# EAGLE design Reciever (EAGLE 9.6.2)
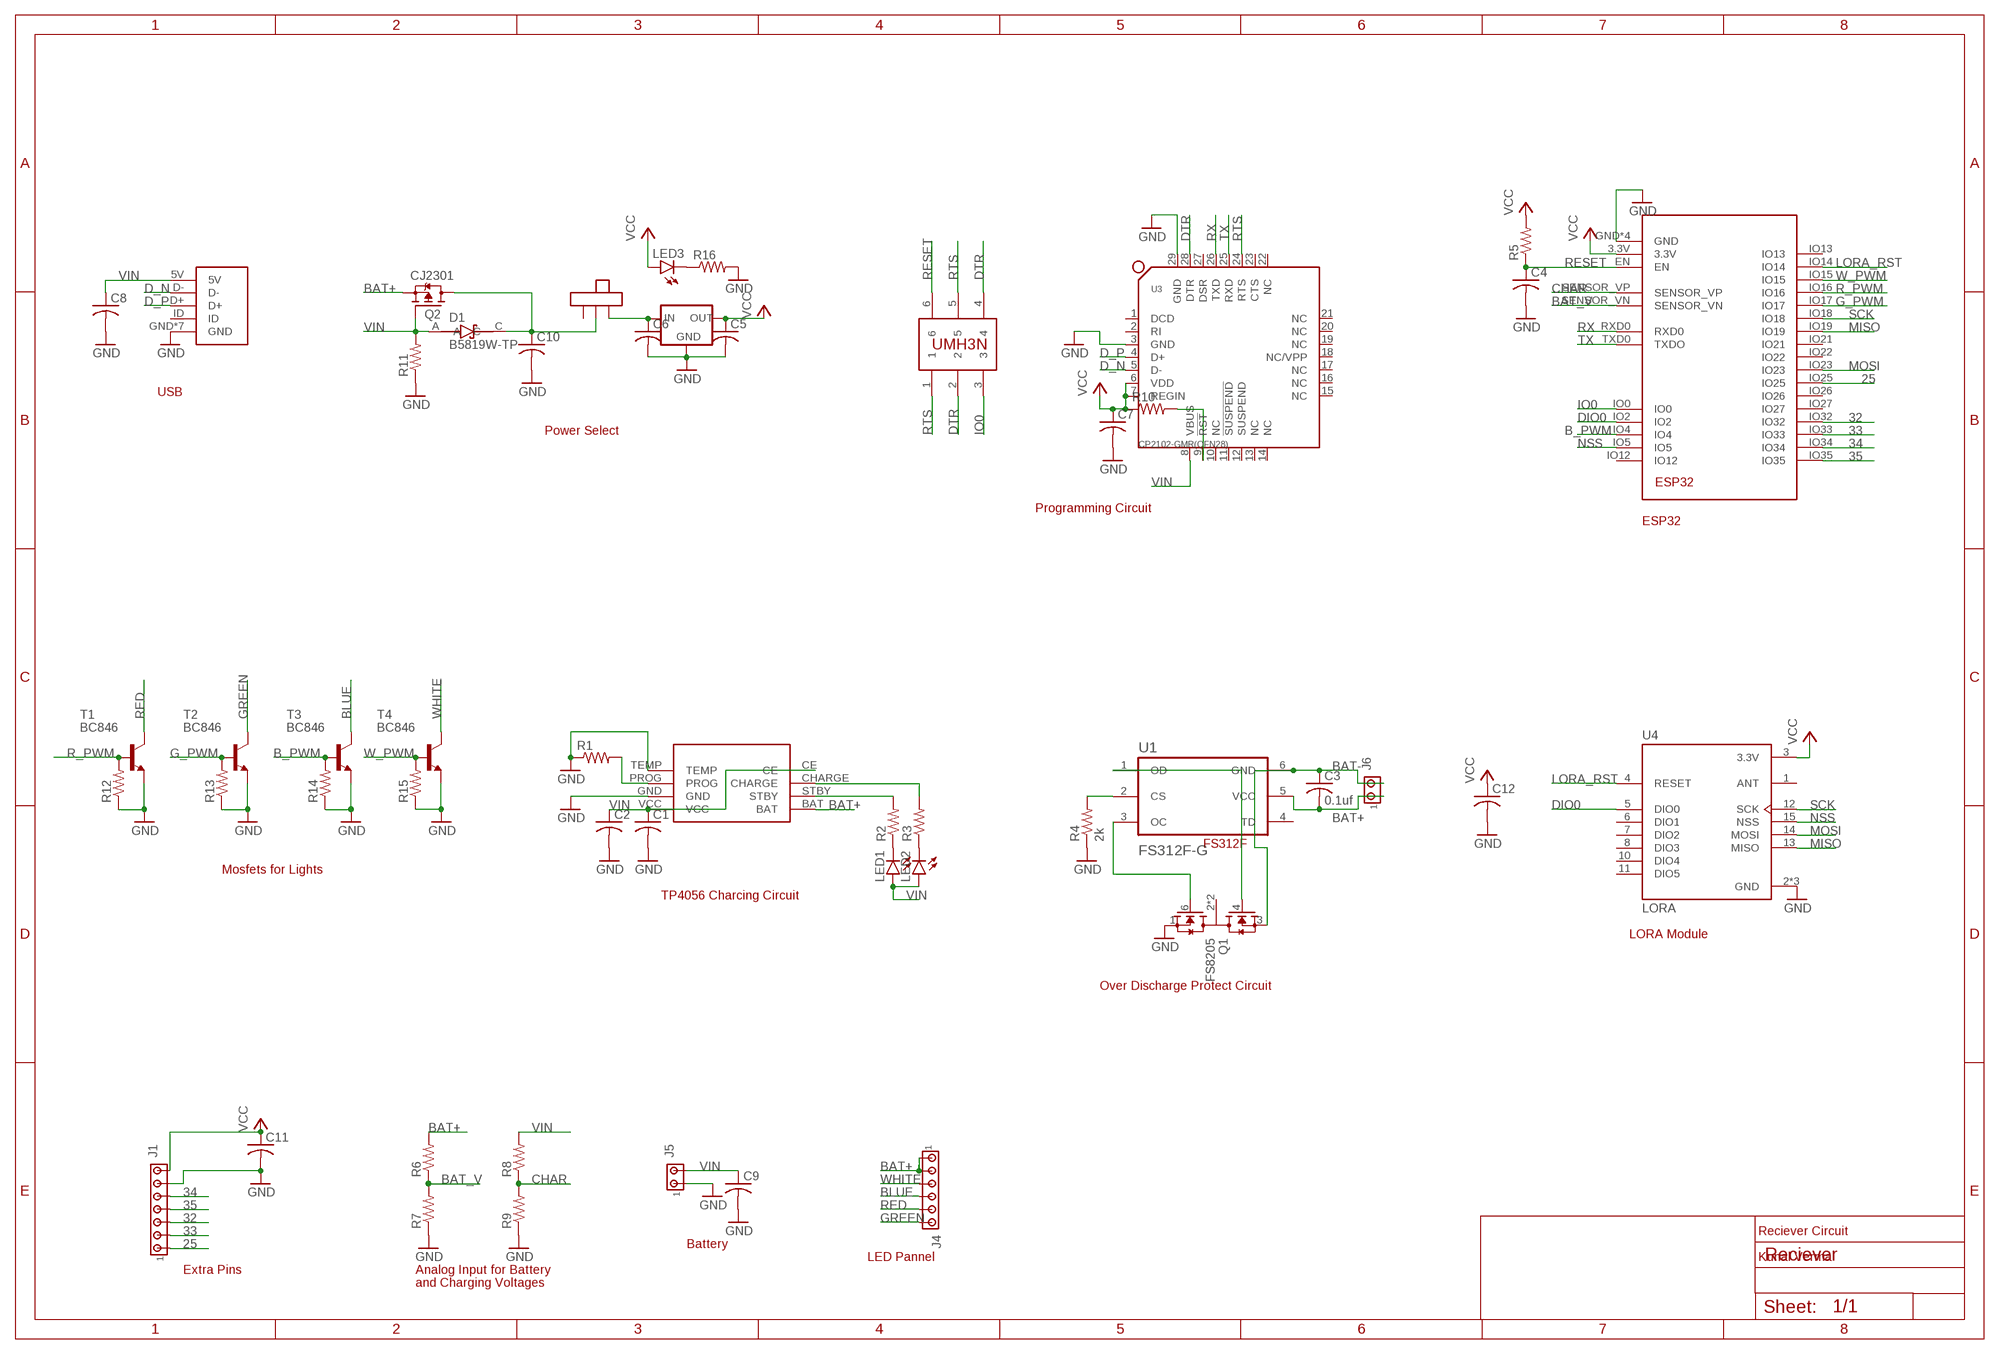
[diagram p0: schematic, sheet 1]

## Parts
C1  C-USC0603  [C0603]
C2  C-USC0603  [C0603]
C3  0.1uf  C-USC0603  [C0603]
C4  C-USC0603  [C0603]
C5  C-USC0603  [C0603]
C6  C-USC0603  [C0603]
C7  C-USC0603  [C0603]
C8  C-USC0603  [C0603]
C9  C-USC0603  [C0603]
C10  C-USC0603  [C0603]
C11  C-USC0603  [C0603]
C12  C-USC0603  [C0603]
D1  B5819W-TP  [SOD3716X135N]
IC1  V_REG3.3MP  [SOT223]
J1  MTA07-100  [10X07MTA]
J4  MTA06-156  [1X6MTA]
J5  MTA02-156  [1X2MTA]
J6  MTA02-156  [1X2MTA]
LED1  LEDCHIPLED_0603  [CHIPLED_0603]
LED2  LEDCHIPLED_0603  [CHIPLED_0603]
LED3  LEDCHIP-LED0603  [CHIP-LED0603]
Q1  FS8205  [SOT95P280X145-6N]
Q2  CJ2301  [SOT95P230X110-3N]
R1  R-US_R0603  [R0603]
R2  R-US_R0603  [R0603]
R3  R-US_R0603  [R0603]
R4  2k  R-US_R0603  [R0603]
R5  R-US_R0603  [R0603]
R6  R-US_R0603  [R0603]
R7  R-US_R0603  [R0603]
R8  R-US_R0603  [R0603]
R9  R-US_R0603  [R0603]
R10  R-US_R0603  [R0603]
R11  R-US_R0603  [R0603]
R12  R-US_R0603  [R0603]
R13  R-US_R0603  [R0603]
R14  R-US_R0603  [R0603]
R15  R-US_R0603  [R0603]
R16  R-US_R0603  [R0603]
T1  BC846  [SOT23]
T2  BC846  [SOT23]
T3  BC846  [SOT23]
T4  BC846  [SOT23]
U1  FS312F-G  [SOT223-6]
U2  ESP32  [MODULE_ESP-WROOM-32]
U3  CP2102-GMR(QFN28)  [QFN28G_0.5-5X5MM]
U4  LORA  [XCVR_RA-01H]
U$1  TP4056  [TP4056]
U$2  SELF-TOOGLE-SWITCH  [SELF-TOOGLE-SWITCH]
U$3  MICROUSB  [USB]
U$4  UMH3N  [UMH3N]

## Nets
25: J1.1 U2.IO25
32: J1.3 U2.IO32
33: J1.2 U2.IO33
34: J1.5 U2.IO34
35: J1.4 U2.IO35
B_PWM: R14.2 T3.1(B) U2.IO4
BAT+: C3.2 J4.1 J4.2 J6.1 Q2.2(S) R6.2 U1.5(VCC) U$1.BAT
BAT-: C3.1 J6.2 Q1.3(S2) U1.6(GND)
BAT_V: R6.1 R7.2 U2.SENSOR_VN
BLUE: J4.4 T3.3(C)
CHAR: R8.1 R9.2 U2.SENSOR_VP
D_N: U3.5(D-) U$3.D-
D_P: U3.4(D+) U$3.D+
DIO0: U2.IO2 U4.5(DIO0)
DTR: U3.28(DTR) U$4.2 U$4.4
G_PWM: R13.2 T2.1(B) U2.IO17
GND: C1.2 C2.2 C4.2 C5.2 C6.2 C7.2 C8.2 C9.2 C10.2 C11.2 C12.2 IC1.GND J1.6 J5.1 Q1.1(S1) R1.1 R4.1 R7.1 R9.1 R11.1 R12.1 R13.1 R14.1 R15.1 R16.2 T1.2(E) T2.2(E) T3.2(E) T4.2(E) U2.GND U2.GND1(GND) U2.GND2(GND) U2.GND3(GND) U3.3(GND) U3.29(GND) U4.2(GND) U4.9(GND) U4.16(GND) U$1.GND U$1.TEMP U$3.GND U$3.GND1(GND) U$3.GND2(GND) U$3.GND3(GND) U$3.GND4(GND) U$3.GND5(GND) U$3.GND6(GND)
GREEN: J4.6 T2.3(C)
IO0: U2.IO0 U$4.3
LORA_RST: U2.IO14 U4.4(RESET)
MISO: U2.IO19 U4.13(MISO)
MOSI: U2.IO23 U4.14(MOSI)
N$1: R1.2 U$1.PROG
N$2: LED1.C R2.1
N$3: R4.2 U1.2(CS)
N$4: LED2.C R3.1
N$5: Q1.4(G2) U1.1(OD)
N$6: R2.2 U$1.STBY
N$7: R3.2 U$1.CHARGE
N$8: Q1.6(G1) U1.3(OC)
N$9: C10.1 D1.C Q2.3(D) U$2.2
N$10: R10.2 U3.9(!RST)
N$11: LED3.C R16.1
N$12: C6.1 IC1.VIN(IN) U$2.3
NSS: U2.IO5 U4.15(NSS)
R_PWM: R12.2 T1.1(B) U2.IO16
RED: J4.5 T1.3(C)
RESET: C4.1 R5.1 U2.EN U$4.6
RTS: U3.24(RTS) U$4.1 U$4.5
RX: U2.RXD0 U3.26(TXD)
SCK: U2.IO18 U4.12(SCK)
TX: U2.TXD0(TXDO) U3.25(RXD)
VCC: C5.1 C7.1 C11.1 C12.1 IC1.VOUT1(OUT) IC1.VOUT(OUT) J1.7 LED3.A R5.2 R10.1 U2.3.3V U3.6(VDD) U3.7(REGIN) U4.3(3.3V)
VIN: C1.1 C2.1 C8.1 C9.1 D1.A J5.2 LED1.A LED2.A Q2.1(G) R8.2 R11.2 U3.8(VBUS) U$1.CE U$1.VCC U$3.5V
W_PWM: R15.2 T4.1(B) U2.IO15
WHITE: J4.3 T4.3(C)
Unconnected: Q1.2(D12) Q1.5(D12) U1.4(TD) U2.IO12 U2.IO13 U2.IO21 U2.IO22 U2.IO26 U2.IO27 U3.1(DCD) U3.2(RI) U3.10(NC) U3.11(!SUSPEND) U3.12(SUSPEND) U3.13(NC) U3.14(NC) U3.15(NC) U3.16(NC) U3.17(NC) U3.18(NC/VPP) U3.19(NC) U3.20(NC) U3.21(NC) U3.22(NC) U3.23(CTS) U3.27(DSR) U4.1(ANT) U4.6(DIO1) U4.7(DIO2) U4.8(DIO3) U4.10(DIO4) U4.11(DIO5) U$2.1 U$3.ID

## Notes on the sheet
- USB
- Power Select
- Programming Circuit
- ESP32
- Mosfets for Lights
- TP4056 Charcing Circuit
- LORA Module
- Over Discharge Protect Circuit
- Reciever Circuit
- Battery
- LED Pannel | Kunal Verma
- Extra Pins | Analog Input for Battery
- and Charging Voltages

## Library data of the parts
C1-C12 = rcl:C-US: CAPACITOR, American symbol; SPICEPREFIX: C
D1 = B5819W-TP:B5819W-TP: Diode Schottky 20v 1a Sod123 Check availability <https://pricing.snapeda.com/parts/B5819W-TP/Micro%20Commercial/view-part?ref=eda>; AVAILABILITY: In Stock; DESCRIPTION: Diode Schottky 40 V 1A Surface Mount SOD-123; MF: Micro Commercial; MP: B5819W-TP; PACKAGE: SOD-123 Multicomp; PRICE: None; PURCHASE-URL: https://pricing.snapeda.com/search/part/B5819W-TP/?ref=eda
IC1 = V_REG:V_REG: 800mA Low-Dropout Linear Regulator Source: http://www.ti.com/lit/ds/symlink/lm1117-n.pdf; MF: Texas Instruments; MPN: LM1117MP-3.3; OC_FARNELL: 9778195; OC_NEWARK: 28X3416
J1 = con-amp:MTA07-100: AMP connector
J4 = con-amp:MTA06-156: AMP connector
J5 J6 = con-amp:MTA02-156: AMP connector
LED1-LED3 = led:LED: LED OSRAM: - CHIPLED LG R971, LG N971, LY N971, LG Q971, LY Q971, LO R971, LY R971 LH N974, LH R974 LS Q976, LO Q976, LY Q976 LO Q996 - Hyper CHIPLED LW Q18S LB Q993, LB Q99A, LB R99A - SideLED LS A670, LO A670, LY A670, LG A670, LP A670 LB A673, LV A673, LT A673, LW A673 LH A674 LY A675 LS A676, LA A676, LO A676, LY A676, LW A676 LS A679, LY A679, LG A679 - Hyper Micro SIDELED® LS Y876, LA Y876, LO Y876, LY Y876 LT Y87S - SmartLED LW L88C, LW L88S LB L89C, LB L89S, LG L890 LS L89K, LO L89K, LY L89K LS L896, LA L896, LO L896, LY L896 - TOPLED LS T670, LO T670, LY T670, LG T670, LP T670 LSG T670, LSP T670, LSY T670, LOP T670, LYG T670 LG T671, LOG T671, LSG T671 LB T673, LV T673, LT T673, LW T673 LH T674 LS T676, LA T676, LO T676, LY T676, LB T676, LH T676, LSB T676, LW T676 LB T67C, LV T67C, LT T67C, LS T67K, LO T67K, LY T67K, LW E67C LS E67B, LA E67B, LO E67B, LY E67B, LB E67C, LV E67C, LT E67C LW T67C LS T679, LY T679, LG T679 LS T770, LO T770, LY T770, LG T770, LP T770 LB T773, LV T773, LT T773, LW T773 LH T774 LS E675, LA E675, LY E675, LS T675 LS T776, LA T776, LO T776, LY T776, LB T776 LHGB T686 LT T68C, LB T68C - Hyper Mini TOPLED® LB M676 - Mini TOPLED Santana® LG M470 LS M47K, LO M47K, LY M47K Source: http://www.osram.convergy.de LUXEON: - LUMILED® LXK2-PW12-R00, LXK2-PW12-S00, LXK2-PW14-U00, LXK2-PW14-V00 LXK2-PM12-R00, LXK2-PM12-S00, LXK2-PM14-U00 LXK2-PE12-Q00, LXK2-PE12-R00, LXK2-PE12-S00, LXK2-PE14-T00, LXK2-PE14-U00 LXK2-PB12-K00, LXK2-PB12-L00, LXK2-PB12-M00, LXK2-PB14-N00, LXK2-PB14-P00, LXK2-PB14-Q00 LXK2-PR12-L00, LXK2-PR12-M00, LXK2-PR14-Q00, LXK2-PR14-R00 LXK2-PD12-Q00, LXK2-PD12-R00, LXK2-PD12-S00 LXK2-PH12-R00, LXK2-PH12-S00 LXK2-PL12-P00, LXK2-PL12-Q00, LXK2-PL12-R00 Source: www.luxeon.com KINGBRIGHT: KA-3528ASYC Source: www.kingbright.com
Q1 = FS8205:FS8205: Dual N Channel Enhancement Mode Power MOSFET Check prices <https://pricing.snapeda.com/parts/FS8205/Fortune%20Semiconductor/view-part?ref=eda>; AVAILABILITY: In Stock; DESCRIPTION: Dual N-Channel Enhancement Mode Power MOSFET; MF: Fortune Semiconductor; MP: FS8205; PACKAGE: Package; PRICE: None
Q2 = PMV65XP_215:CJ2301: Single P-Channel 20 V 833 mW 7.7 nC Silicon Surface Mount Mosfet - SOT-23 Check availability <https://pricing.snapeda.com/parts/PMV65XP%2C215/Nexperia%20USA%20Inc./view-part?ref=eda>; AVAILABILITY: In Stock; DESCRIPTION: P-Channel 20 V 2.8A (Ta) 480mW (Ta) Surface Mount TO-236AB; MF: Nexperia USA Inc.; MP: PMV65XP,215; PACKAGE: SOT23-3 Nexperia USA Inc.; PRICE: None; PURCHASE-URL: https://pricing.snapeda.com/search/part/PMV65XP,215/?ref=eda
R1-R16 = rcl:R-US_: RESISTOR, American symbol; SPICEPREFIX: R
T1-T4 = transistor:BC846: NPN TRANSISTOR
U1 = REF3440IDBVR:FS312F-G: Check prices <https://pricing.snapeda.com/parts/REF3440IDBVR/Texas%20Instruments/view-part?ref=eda>; AVAILABILITY: In Stock; DESCRIPTION: 4.1-V low-drift low-power small-footprint series voltage reference 6-SOT-23 -40 to 125; MF: Texas Instruments; MP: REF3440IDBVR; PACKAGE: SOT-23-6 Texas Instruments; PRICE: None; PURCHASE-URL: https://pricing.snapeda.com/search/part/REF3440IDBVR/?ref=eda
U2 = ESP-WROOM-32:ESP32: Module: combo; GPIO, I2C x2, I2S x2, SDIO, SPI x3, UART x3; 19.5dBm
U3 = CP2102-GMR_QFN28_:CP2102-GMR(QFN28): 310070003 Check prices <https://pricing.snapeda.com/parts/CP2102-GMR/Silicon/view-part?ref=eda>; AVAILABILITY: Warning; DESCRIPTION: USB Bridge, USB to UART USB 2.0 UART Interface 28-QFN (5x5); MF: Silicon; MP: CP2102-GMR; PACKAGE: VFQFN-28 Vishay Siliconix; PRICE: None; PURCHASE-URL: https://pricing.snapeda.com/search/part/CP2102-GMR/?ref=eda
U4 = RA-01H:LORA: Ai-Thinker Lora Series Module Check availability <https://pricing.snapeda.com/parts/RA-01H/AI-Thinker/view-part?ref=eda>; AVAILABILITY: Not in stock; DESCRIPTION: Ai-Thinker Lora Series Module; MF: AI-Thinker; MP: RA-01H; PACKAGE: Package; PRICE: None
U$1 = TP4056:TP4056
U$2 = SELF-TOOGLE-SWITCH:SELF-TOOGLE-SWITCH
U$3 = micro usb:MICROUSB
U$4 = UMH3N:UMH3N

## Board
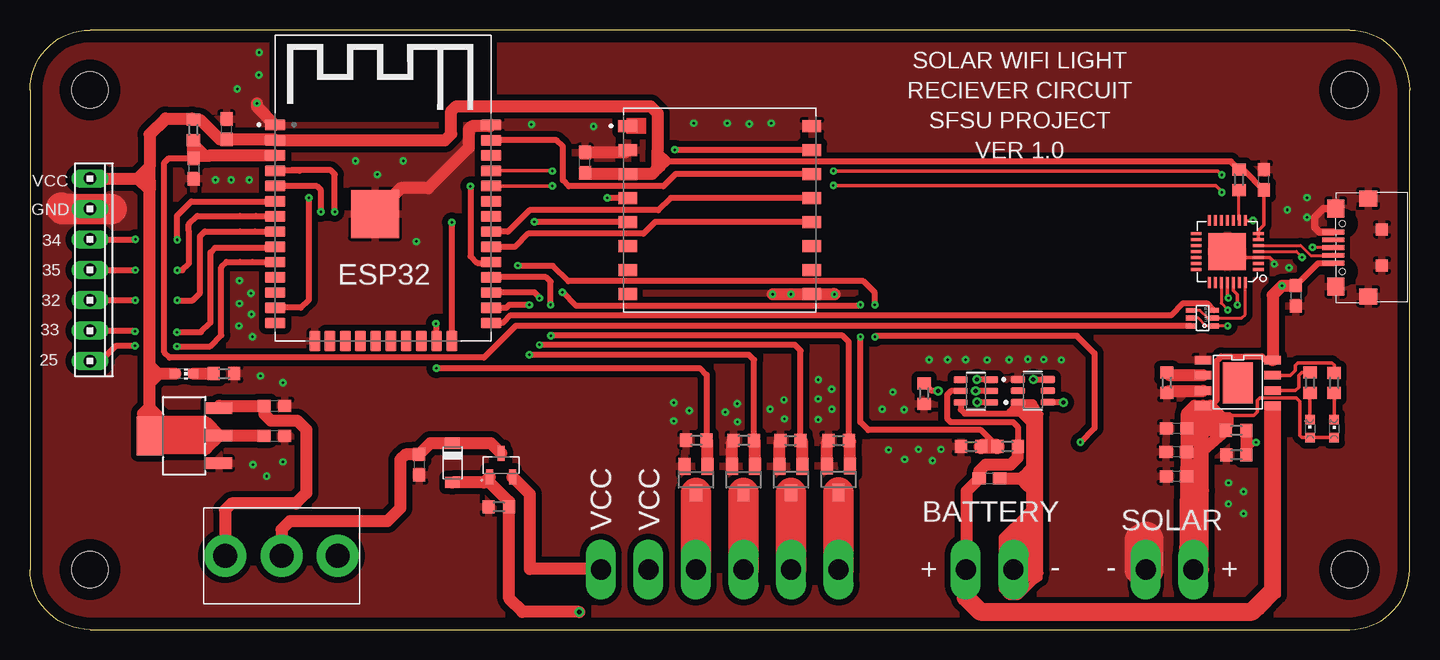
[diagram p1: board, top side]
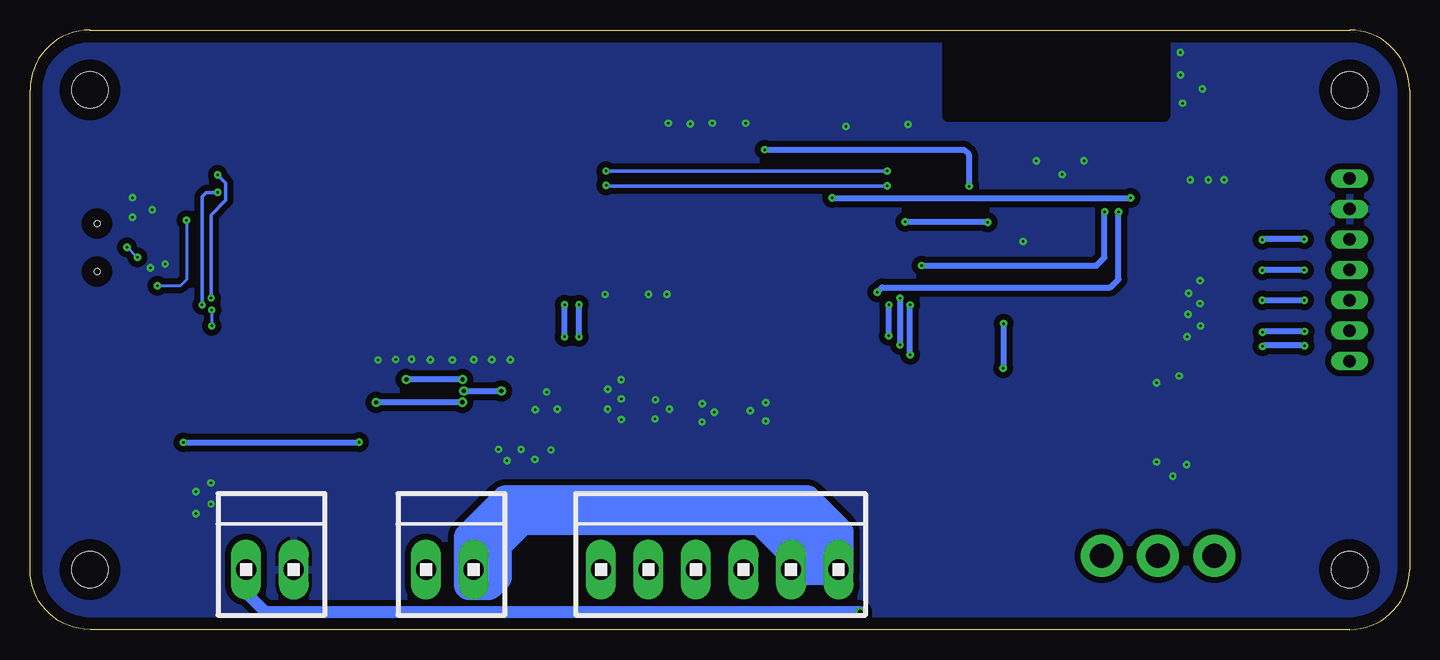
[diagram p2: board, bottom side, seen from below]

Size 115 x 50 mm. Coordinates in mm from the lower left corner, seen from the top.
Outline: 5,0 110,0 arc90 115,5 115,45 arc90 110,50 5,50 arc90 0,45 0,5 arc90 5,0
Copper layers (1*16): Top 0.035mm / dielectric 1.5mm / Bottom 0.035mm
Design rules "default *": minimum track width 6mil, minimum drill 0.35mm, track to track 6mil, track to pad 6mil, pad to pad 6mil, via to via 6mil, smd to smd 6mil, copper to edge 40mil, drill to drill 6mil, minimum pad ring 10mil, minimum via ring 8mil, stop-mask expansion 4mil, vias tented up to drill 100mil, thermal gap 10mil
Holes 3 mm at 5,5 110,5 5,45 110,45

### Footprints (pad centres in the part's own frame; a part is rotated, then mirrored left to right if it is on the bottom)
C0603 = smd 1.1 x 1: 1 -0.85,0; 2 0.85,0
SOD3716X135N = smd 0.914 x 1.219: A 1.638,0; C -1.638,0
SOT223 = smd 0.95 x 2.15: GND -2.3,-2.9; VIN 2.3,-2.9; VOUT 0,-2.9 | smd 3.25 x 2.15: VOUT1 0,2.9
10X07MTA = drill 1.016 long: 1 7.62,0; 2 5.08,0; 3 2.54,0; 4 0,0; 5 -2.54,0; 6 -5.08,0; 7 -7.62,0
1X6MTA = drill 1.676 long: 1 9.906,0; 2 5.944,0; 3 1.981,0; 4 -1.981,0; 5 -5.944,0; 6 -9.906,0
1X2MTA = drill 1.676 long: 1 1.981,0; 2 -1.981,0
CHIPLED_0603 = smd 0.8 x 0.8: A 0,-0.75; C 0,0.75
CHIP-LED0603 = smd 0.8 x 0.8: A 0,-0.75; C 0,0.75
SOT95P280X145-6N = smd 1.21 x 0.59: 1 -1.255,0.95; 2 -1.255,0; 3 -1.255,-0.95; 4 1.255,-0.95; 5 1.255,0; 6 1.255,0.95
SOT95P230X110-3N = smd 0.59 x 1.26: 1 -0.95,-0.98; 2 0.95,-0.98; 3 0,0.98
R0603 = smd 1 x 1.1: 1 -0.85,0; 2 0.85,0
SOT23 = smd 1 x 1.4: 1 -0.95,-1.1; 2 0.95,-1.1; 3 0,1.1
SOT223-6 = smd 1.21 x 0.58: 1 -1.255,0.95; 2 -1.255,0; 3 -1.255,-0.95; 4 1.255,-0.95; 5 1.255,0; 6 1.255,0.95
MODULE_ESP-WROOM-32 = smd 1.7 x 0.9: 3.3V -9,6.985; EN -9,5.715; GND -9,8.255; GND3 9,8.255; IO0 9,-8.255; IO4 9,-6.985; IO5 9,-3.175; IO12 -9,-8.255; IO14 -9,-6.985; IO16 9,-5.715; IO17 9,-4.445; IO18 9,-1.905; IO19 9,-0.635; IO21 9,1.905; IO22 9,5.715; IO23 9,6.985; IO25 -9,-3.175; IO26 -9,-4.445; IO27 -9,-5.715; IO32 -9,-0.635; IO33 -9,-1.905; IO34 -9,1.905; IO35 -9,0.635; NC 9,0.635; RXD0 9,3.175; SENSOR_VN -9,3.175; SENSOR_VP -9,4.445; TXD0 9,4.445 | smd 0.9 x 1.7: CLK 0.635,-9.755; CMD -0.635,-9.755; GND2 -5.715,-9.755; IO2 5.715,-9.755; IO13 -4.445,-9.755; IO15 4.445,-9.755; SD0 1.905,-9.755; SD1 3.175,-9.755; SD2 -3.175,-9.755; SD3 -1.905,-9.755 | smd 4 x 4: GND1 -0.7,0.845
QFN28G_0.5-5X5MM = smd 0.9 x 0.254: 1 -2.59,1.5; 2 -2.59,1; 3 -2.59,0.5; 4 -2.59,0; 5 -2.59,-0.5; 6 -2.59,-1; 7 -2.59,-1.5; 15 2.59,-1.5; 16 2.59,-1; 17 2.59,-0.5; 18 2.59,0; 19 2.59,0.5; 20 2.59,1; 21 2.59,1.5 | smd 0.254 x 0.9: 8 -1.5,-2.59; 9 -1,-2.59; 10 -0.5,-2.59; 11 0,-2.59; 12 0.5,-2.59; 13 1,-2.59; 14 1.5,-2.59; 22 1.5,2.59; 23 1,2.59; 24 0.5,2.59; 25 0,2.59; 26 -0.5,2.59; 27 -1,2.59; 28 -1.5,2.59 | smd 3.1 x 3.1: 29 0,0
XCVR_RA-01H = smd 1.536 x 1: 1 -7.682,7; 2 -7.682,5; 3 -7.682,3; 4 -7.682,1; 5 -7.682,-1; 6 -7.682,-3; 7 -7.682,-5; 8 -7.682,-7; 9 7.682,-7; 10 7.682,-5; 11 7.682,-3; 12 7.682,-1; 13 7.682,1; 14 7.682,3; 15 7.682,5; 16 7.682,7
TP4056 = smd 1.4 x 0.7: BAT 2.9,-1.27; CE 2.9,2.54; CHARGE 2.9,1.27; GND -2.9,0; PROG -2.9,1.27; STBY 2.9,0; TEMP -2.9,2.54; VCC -2.9,-1.27 | smd 2.5 x 3.4: PAD 0,0.635
SELF-TOOGLE-SWITCH = drill 2 pad 3.5: 1 -4.7,0; 2 0,0; 3 4.7,0
USB = smd 0.4 x 1.8: 5V -1.298,0.204; D+ 0.002,0.204; D- -0.648,0.204; GND 1.302,0.204; ID 0.652,0.204 | smd 1.5 x 1.4: GND1 3.25,0; GND6 -3.25,0 | smd 1.35 x 1.5: GND2 4.075,-2.7; GND5 -4.075,-2.7 | smd 1 x 1: GND3 1.5,-3.85; GND4 -1.5,-3.85 | hole 0.5: -2,-0.55; 2,-0.55
UMH3N = smd 0.4 x 0.8: 1 -0.65,-0.97; 2 0,-0.97; 3 0.65,-0.97; 4 0.65,0.97; 5 0,0.97; 6 -0.65,0.97

### Placement (x,y rotation side)
C1  95.56,14.81 180 top
C2  95.59,16.79 180 top
C3  79.98,12.59 180 top
C4  13.64,38.44 270 top
C5  20.37,16.17 0 top
C6  20.37,18.67 0 top
C7  102.86,37.52 90 top
C8  105.51,27.83 270 top
C9  95.57,12.78 180 top
C10  32.44,13.75 270 top
C11  16.39,41.73 90 top
C12  46.25,38.94 90 top
D1  35.22,13.89 270 top
IC1  12.87,16.17 90 top
J1  5,30 270 top
J4  57.5,5 0 bottom
J5  95,5 0 bottom
J6  80,5 0 bottom
LED1  106.7,16.75 0 top
LED2  108.72,16.75 0 top
LED3  12.86,21.32 270 top
Q1  83.6,19.9 0 top
Q2  39.27,13.71 0 top
R1  94.76,20.58 90 top
R2  106.7,20.58 90 top
R3  108.72,20.56 90 top
R4  74.54,19.68 90 top
R5  13.62,41.67 90 top
R6  81.49,15.27 0 top
R7  78.45,15.26 0 top
R8  100.56,16.62 180 top
R9  100.56,14.57 0 top
R10  100.78,37.51 270 top
R11  39.09,10.23 0 top
R12  63.4,15.77 0 top
R13  67.41,15.77 0 top
R14  59.51,15.78 0 top
R15  55.55,15.79 0 top
R16  16.17,21.34 0 top
T1  63.43,12.51 180 top
T2  67.41,12.53 180 top
T3  59.48,12.5 180 top
T4  55.52,12.49 180 top
U1  78.85,19.89 180 top
U2  29.45,33.82 0 top
U3  99.79,31.53 180 top
U4  57.5,35 0 top
U$1  100.69,19.93 0 top
U$2  20.96,6.15 180 top
U$3  108.85,31.85 90 top
U$4  97.72,25.97 90 top

### Tracks (layer width: path | path; a pad name or v marks a point on that pad's centre or on a via)
25  (via drill 0.2)
  Top 0.508: J1.1 5.91,22.38 7.2,23.67 v8.75,23.67 | v12.25,23.61 15,23.61 15.94,24.55 15.94,30.21 16.39,30.66 17.5,30.66 18.54,30.66 20.43,30.66 U2.IO25
  Bottom 0.508: v8.75,23.67 12.19,23.67 v12.25,23.61
32  (via drill 0.2)
  Top 0.508: J1.3 v8.77,27.46 v8.78,27.45 | v12.27,27.45 13.57,27.45 14.19,28.07 14.19,32.81 14.57,33.19 17.5,33.19 18.74,33.19 20.44,33.19 U2.IO32
  Bottom 0.508: v8.78,27.45 v12.27,27.45
33  (via drill 0.2)
  Top 0.508: J1.2 8.69,24.92 v8.75,24.86 | v12.25,24.8 14.25,24.8 15.04,25.59 15.04,31.46 15.43,31.84 20.38,31.84 U2.IO33
  Bottom 0.508: v8.75,24.86 12.19,24.86 v12.25,24.8
34  (via drill 0.2)
  Top 0.508: J1.5 8.77,32.54 v8.78,32.55 | v12.27,32.5 12.27,34.51 13.46,35.7 20.42,35.7 U2.IO34
  Bottom 0.508: v8.78,32.55 12.21,32.55 v12.27,32.5
35  (via drill 0.2)
  Top 0.508: J1.4 8.76,30 v8.78,29.98 | v12.27,29.97 12.69,29.97 13.26,30.54 13.26,33.2 13.24,33.22 13.24,33.8 13.94,34.5 17.5,34.5 18.83,34.5 20.41,34.5 U2.IO35
  Bottom 0.508: v8.78,29.98 12.26,29.98 v12.27,29.97
B_PWM  (via drill 0.2)
  Top 0.508: R14.2 60.36,22.48 59.93,22.91 v41.64,22.91 | v41.64,27.07 39.94,27.07 39.69,26.82 38.47,26.82 U2.IO4
  Top 1.016: T3.1 60.42,15.71 R14.2
  Bottom 0.508: v41.64,22.91 v41.64,27.07
BAT+
  Top 0.508: U$1.BAT 103.12,18.19 103.12,3.48 103.49,3.12 | U$1.BAT 103.88,18.37 104.03,18.37 104.03,2.88 102.65,1.49 101.86,1.49 | U$1.BAT 103.59,3.22 102.92,2.56 | U1.5 76.76,19.89 76.44,19.58 76.44,17.62 76.75,17.31 81.94,17.31 82.35,16.91 R6.2
  Top 1.016: J6.1 78.07,5.05 78.07,11.52 C3.2 79.13,13.22 79.67,13.76 81.75,13.76 82.34,14.35 R6.2 | Q2.2 41.65,11.3 41.65,5.05 47.55,5.05 J4.1
  Top 1.5: J6.1 78.02,2.69 79.21,1.49 101.86,1.49 102.92,2.56 103.49,3.12
  Bottom 2.54: J4.2 J4.1 47.59,8.11 50.28,10.79 75.29,10.79 78.02,8.07 | J4.2 51.56,6.59 54.09,9.13 74.04,9.13 76.12,7.04 76.12,4.36 76.76,3.73 78.4,3.73 78.4,4.62 | 78.4,4.62 J6.1 78.02,8.07 | 78.02,8.07 78.4,7.69 78.4,4.62 | J4.2 50.49,6.06 49.93,6.06 49.93,7.58 51.13,8.78 52.37,8.78
BAT-
  Top 0.508: 83.63,18.95 82.86,18.95 | 82.86,18.95 82.55,18.95 | 82.55,18.95 Q1.3 | 82.48,18 83.27,17.22 83.27,13.2 83.27,11.9 83.27,10 82.88,9.61 | 82.48,18 81.98,18.51 | 82.88,9.61 80.99,7.72 80.99,5.16 | 80.99,5.16 80.99,3.34 81.58,2.75 82.44,2.75 83.67,3.97 | 83.67,3.97 83.67,4.29 | 83.67,4.29 83.67,9.79 | 83.72,12.55 83.72,9.86 83.67,9.79 | 83.72,18.87 83.72,17.79 | 83.72,18.87 83.63,18.95 | Q1.3 81.98,18.59 81.98,18.51 | Q1.3 83.03,17.66 | 83.03,17.66 83.25,17.24 | 82.55,18.95 83.03,17.66 | 83.72,18.87 83.19,18.5 | 82.48,18 83.19,18.5 | 83.19,18.5 82.86,18.95 | 83.19,18.5 83.72,17.25 | 80.99,5.16 81.67,5.05 J6.2 83.25,4.47 | 83.05,8.91 83.37,9.38 | 83.37,9.38 83.67,9.79 | 83.37,9.38 82.88,9.61 | 83.63,18.95 84.23,17.94 84.23,4.71 84.19,4.67 84.19,4.3 83.67,3.97 | 83.25,4.47 83.67,4.29 | 83.67,4.29 83.72,4.27 | 83.67,3.97 83.25,4.47 | U1.6 77.59,18.34 77.92,18 81.68,18 | 81.68,18 82.48,18 | 81.98,18.51 81.68,18.2 81.68,18
  Top 0.813: 83.72,17.79 83.72,17.25 83.72,12.55 83.72,4.27
  Top 1.016: J6.2 81.61,5.79 | J6.2 81.64,6.79 81.61,7.3 83.05,8.91 83.02,4.41 82.59,3.95 | 82.59,3.95 82.15,3.47 81.77,3.45 81.67,3.88 81.67,5.05 | J6.2 82.4,7.21 | J6.2 82.59,3.95 | C3.1 82.55,12.59 | 82.65,12.59 83.68,12.59 83.72,12.55 | 82.65,12.59 82.55,12.59 | 82.65,12.59 83.27,13.2 | 82.55,12.59 83.23,11.9 83.27,11.9
BAT_V  (via drill 0.2)
  Top 0.508: R6.1 79.27,16.64 69.89,16.64 69.23,17.3 v69.23,24.4 | v69.23,27.07 69.14,26.99 45.53,26.99 44.39,28.14 v44.38,28.12 | v24.26,34.83 24.26,36.64 23.93,36.97 20.47,36.97 U2.SENSOR_VN
  Top 1.27: R6.1 R7.2
  Bottom 0.508: v69.23,24.4 v69.23,27.07 | v44.38,28.12 43.97,28.53 24.93,28.53 24.26,29.21 v24.26,34.83
BLUE
  Top 2.54: T3.3 J4.4
CHAR  (via drill 0.2)
  Top 0.508: 101.41,15 102.02,15.6 v102.21,15.6 | v87.56,15.62 88.75,16.8 88.75,23.02 87.28,24.48 70.51,24.48 v70.43,24.41 | v70.43,27.08 70.43,28.09 69.47,29.04 44.88,29.04 43.6,30.33 40.67,30.33 v40.67,30.35 | v25.4,34.82 25.4,37.96 25.07,38.29 22.5,38.29 | 22.5,38.29 21.78,38.29 | 22.5,38.29 22.47,38.27 U2.SENSOR_VP
  Top 1.016: R8.1 101.41,16.61 101.41,15 R9.2
  Bottom 0.508: v102.21,15.6 87.57,15.6 v87.56,15.62 | v70.43,24.41 v70.43,27.07 v70.43,27.08 | v40.67,30.35 26.1,30.35 25.43,31.02 25.43,34.8 v25.4,34.82 | v25.4,34.82
D_N
  Top 0.254: U3.5 105.94,32.03 106.76,31.21 U$3.D-
D_P  (via drill 0.2)
  Top 0.254: U3.4 105.56,31.53 v106.05,31.04 | v106.92,31.88 108.63,31.88 U$3.D+
  Bottom 0.254: v106.05,31.04 106.89,31.88 v106.92,31.88
DIO0  (via drill 0.2)
  Top 0.508: U4.5 v42.05,34 | v35.16,33.97 v35.16,33.96 U2.IO2
  Bottom 0.508: v42.05,34 35.19,34 v35.16,33.97
DTR
  Top 0.254: U3.28 101.29,26.24 101.02,25.97 U$4.2 98.19,25.97 97.54,26.62 U$4.4
G_PWM  (via drill 0.2)
  Top 0.508: R13.2 68.26,23.99 67.75,24.51 43.43,24.51 v43.42,24.49 | v43.4,27.07 43.4,29 43.01,29.39 38.46,29.39 U2.IO17
  Top 1.016: T2.1 68.36,15.67 R13.2
  Bottom 0.508: v43.42,24.49 43.42,27.05 v43.4,27.07
GND  (via drill 0.2)
  Top 0.305: U3.29 99.79,31.5 100.27,31.03 U3.3 103.36,31.03 103.94,30.44
  Top 0.61: U$3.GND 107.48,33.16 107.1,33.53 107.1,34.39 107.81,35.11 U$3.GND1
  Top 1.016: U4.2 49.61,39.79 C12.2 | U2.GND3 38.34,41.97 36.82,41.97 36.57,41.73 36.57,40.17 33.2,36.79 30.88,36.79 U2.GND1 | R1.1 94.91,19.87 97.74,19.87 U$1.GND | v61.9,27.96 v63.44,27.96 65.14,27.96 U4.9 67.01,28 v67.07,27.94 | T2.2 66.46,15.66 R13.1 | T1.2 62.48,15.7 R12.1 | T3.2 58.52,15.65 R14.1 | U2.GND 18.92,43.61 v18.92,43.89
  Top 2.54: 93.02,7.5 92.5,7.5 92.5,5 | 2.61,35.18 2.71,35.08 J1.6 6.79,35.08 6.83,35.04
  Top 3: J5.1 93.02,7.5
  other vias: 65.71,17.51 66.85,18.38 65.72,19.23 66.83,20.05 65.72,20.82 62.9,17.56 61.69,18.39 62.85,19.15 58.98,17.31 57.95,18.11 58.95,18.83 53.67,17.39 54.96,18.25 53.66,18.91 19.22,21.15 21.08,20.58 18.58,13.75 21.08,13.98 19.73,12.8 19.08,46.24 19.1,48.12 17.28,45.08 27.14,39.08 31.11,39.08 28.95,37.95 32.21,32.36 55.34,42.23 58.12,42.23 61.78,42.23 41.8,42.13 46.98,41.95 59.97,42.16 106.46,34.37 106.46,36.02 104.82,35 18.55,24.42 18.47,26.29 18.43,28.04 17.45,27.19 17.41,25.32 17.45,29.1 71.04,18.37 72.86,18.33 71.93,19.8 75.95,15.02 74.06,15.02 71.57,14.98 72.91,14.19 75.24,14.09 81.62,22.5 83.19,22.54 84.52,22.52 85.98,22.48 79.79,22.48 78.01,22.49 76.5,22.5 74.95,22.49 99.92,12.23 101.16,11.5 99.9,10.47 101.18,9.68 103.73,30.48 104.95,30.17 15.47,37.5 16.77,37.5 18.28,37.5
  pour Top (isolate 0.5): -2.5,0 -2.5,52.5 117.5,52.5 117.5,-2.5 -2.5,-2.5
  pour Bottom (isolate 0.5): -10,-7.5 -10,57.5 122.5,57.5 125,57.5 125,-7.5
GREEN
  Top 2.54: T2.3 J4.6 | J4.6
IO0
  Top 0.508: U$4.3 98.08,27.23 96.12,27.23 96.12,27.22 95.13,26.23 40.08,26.23 40.08,26.22 39.43,25.57 39.42,25.56 U2.IO0
LORA_RST  (via drill 0.2)
  Top 0.508: U4.4 v48.14,36 | v23.24,36 23.24,27.5 22.58,26.83 U2.IO14
  Bottom 0.508: v48.14,36 v23.24,36
MISO
  Top 0.508: U4.13 53.41,36 52.37,34.96 41.63,34.96 39.85,33.19 U2.IO19
MOSI
  Top 0.508: U4.14 53.82,38 52.8,36.97 44.91,36.97 44.42,37.47 44.42,40.3 43.91,40.81 U2.IO23
N$1
  Top 1.016: U$1.PROG 95,21.2 R1.2
N$2
  Top 0.305: R2.1 LED1.C
N$3  (via drill 0.35)
  Top 0.508: U1.2 v78.84,19.89 v78.83,19.9 | v75.71,19.9 75.17,19.9 R4.2
  Bottom 0.508: v78.83,19.9 v75.71,19.9
N$4
  Top 0.305: R3.1 | R3.1 LED2.C
N$5  (via drill 0.35)
  Top 0.508: U1.1 v78.96,18.96 | v86.14,18.95 Q1.4
  Bottom 0.508: v78.96,18.96 v86.14,18.95
N$6
  Top 0.305: U$1.STBY 105.5,19.92 105.78,20.2 105.78,21.2 106.01,21.43 R2.2
N$7
  Top 0.305: U$1.CHARGE 105.08,21.2 105.48,21.6 105.48,22.03 105.69,22.24 108.53,22.24 108.72,22.05 R3.2
N$8  (via drill 0.35)
  Top 0.508: U1.3 v78.94,20.85 | v83.63,20.85 Q1.6
  Bottom 0.508: v78.94,20.85 v83.63,20.85
N$9
  Top 1.016: Q2.3 38.43,15.53 D1.C 33.37,15.53 C10.1 31.29,14.6 30.86,14.17 30.86,10.11 29.78,9.03 21.65,9.03 20.96,8.34 U$2.2
N$10
  Top 0.254: U3.9 R10.2
N$11
  Top 1.016: LED3.C 13.63,21.34 R16.1
N$12
  Top 1.016: IC1.VIN 15.77,18.67 C6.1 19.52,17.97 20.07,17.43 22.26,17.43 23.02,16.67 23.02,11.39 22.15,10.51 16.8,10.51 16.26,9.97 U$2.3
NSS  (via drill 0.2)
  Top 0.508: U4.15 53.77,40 v53.75,40.02 | v36.71,36.97 36.71,31.14 37.28,30.57 38.38,30.57 U2.IO5
  Bottom 0.508: v53.75,40.02 37.14,40.02 36.75,39.63 36.75,37.01 v36.71,36.97
R_PWM  (via drill 0.2)
  Top 0.508: R12.2 64.25,23.25 63.77,23.73 v42.47,23.73 | v42.47,27.64 42.47,27.69 42.05,28.11 U2.IO16
  Top 1.016: T1.1 64.38,15.63 R12.2
  Bottom 0.508: v42.47,23.73 | v42.47,27.64 v42.47,23.73
RED
  Top 2.54: T1.3 J4.5
RESET
  Top 0.508: U$4.6 95.41,25.32 | 95.41,25.32 95.4,25.31 | 95.41,25.32 40.49,25.32 37.85,22.68 11.63,22.68 11.2,23.11 11.2,38.94 11.57,39.31 13.62,39.31 | 18.59,39.51 18.62,39.53 | 15,39.53 14.9,39.53 R5.1 | 17.97,39.52 17.96,39.53
  Top 1.016: R5.1 13.62,39.31 C4.1 13.89,39.53 15,39.53 17.96,39.53 18.62,39.53 U2.EN
RTS  (via drill 0.2)
  Top 0.254: U3.24 99.29,27.22 v99.86,26.66 v99.86,26.65 | v99.85,25.32 v99.84,25.32 U$4.1 98.03,25.32 97.38,25.97 U$4.5
  Bottom 0.254: v99.86,26.65 v99.86,25.33 v99.85,25.32
RX  (via drill 0.2)
  Top 0.305: U2.RXD0 v43.53,37 v43.54,37 | v66.97,37.04 98.84,37.04 99.36,36.53 v99.36,36.45 | v100.65,27.07 100.65,27.92 100.29,28.28 U3.26
  Bottom 0.305: v43.54,37 66.93,37 v66.97,37.04 | v99.36,36.45 100.31,36.45 100.65,36.1 v100.65,27.07
SCK
  Top 0.508: U4.12 52.12,34 51.14,33.01 41.52,33.01 40.42,31.92 U2.IO18
TX  (via drill 0.2)
  Top 0.305: U2.TXD0 43.51,38.27 v43.54,38.24 | v66.97,38.24 99.03,38.24 v99.36,37.91 | v99.9,27.64 99.82,27.73 99.82,28.91 U3.25
  Bottom 0.305: v43.54,38.24 v66.97,38.24 | v99.36,37.91 98.67,37.23 98.67,35.79 99.9,34.57 v99.9,27.64
VCC
  Top 0.305: U3.6 U3.7 102.38,33.26 102.86,33.73 C7.1
  Top 0.508: 53.31,39.02 100.12,39.02 R10.1 101.17,38.36 C7.1 | 53.26,39.02 53.31,39.02 | 52.33,38.47 52.71,38.47 53.26,39.02 | 52.33,40 53.31,39.02 | 53.26,39.02 52.36,39.02 52.33,38.99
  Top 1.016: C5.1 IC1.VOUT | IC1.VOUT 11.51,16.17 | 11.51,16.17 IC1.VOUT1 9.97,17.5 | IC1.VOUT 14.64,17.29 10.71,17.29 | 10.71,17.29 10.38,17.29 11.51,16.17 | IC1.VOUT 12.89,16.17 11.76,17.29 | IC1.VOUT 14.53,16.17 13.96,16.74 | IC1.VOUT 13.76,16.17 13.19,16.74 | IC1.VOUT 12.87,16.17 | IC1.VOUT 14.7,15.09 10.77,15.09 10.77,15.62 14.36,15.62 | 9.97,20.58 9.97,21.3 | 9.97,21.3 9.97,22.02 | 9.97,22.02 9.97,36.63 | 9.97,37.5 9.97,37.74 | 9.97,38.61 9.97,41.3 11.3,42.62 13.52,42.62 R5.2 14.19,42.52 15.83,40.88 C11.1 20.38,40.88 U2.3.3V 34.59,40.81 35.12,41.33 35.12,43.24 35.52,43.64 51.75,43.64 52.33,43.06 52.33,40 52.33,38.99 52.33,38.47 51.86,38 U4.3 46.34,38 C12.1 | LED3.A 9.99,21.32 9.97,21.3 | LED3.A 10.67,21.32 9.97,22.02 | LED3.A 10.71,21.32 9.97,20.58 | J1.7 8.99,37.62 | 8.99,37.62 9.85,37.62 | 9.85,37.62 9.97,37.74 | 9.97,37.74 9.97,38.61 | 9.97,38.61 8.99,37.62 | 9.85,37.62 9.97,37.5 | 9.97,37.5 9.97,36.63 | 9.97,36.63 8.99,37.62 | 9.97,18.48 9.97,20.58 | 9.97,17.5 9.47,18.01 9.42,18.01 9.89,18.48 9.97,18.48 | 9.97,18.48 9.97,17.5 | 9.97,18.48 10.71,17.74 10.71,17.29
VIN  (via drill 0.2, 0.35)
  Top 0.254: U3.8 v101.96,34.12 | C8.1 107.39,30.56
  Top 0.305: 99.19,17.84 100.05,17.84 102.04,17.84 102.32,18.13 102.32,19.09 102.54,19.31 105.55,19.31 105.84,19.02 105.84,16.2 106.04,16 LED1.A LED2.A
  Top 0.508: U$1.VCC 98.44,18.66 | U$1.CE 103.01,22.47 102.7,22.78 99.29,22.78 98.93,22.41 98.93,19.14 98.44,18.66 | 99.7,17.33 100.05,17.67 | 100.05,17.67 100.05,17.84 | 100.05,17.67 100.05,16.96 R8.2 99.7,17.5 100.05,17.84 | 100.05,17.84 99.25,17.84 98.44,18.66 | U$3.5V 107.39,30.56 105.5,28.67
  Top 1.016: C9.1 96.42,14.38 | 96.42,14.38 96.42,15.81 | 96.42,15.81 96.42,16.77 C2.1 | C2.1 96.44,18.02 97.07,18.66 U$1.VCC | U$1.VCC 98.38,18.66 99.19,17.84 99.7,17.33 R8.2 | R8.2 97.55,16.62 97.55,15.87 | 97.55,15.87 97.49,15.81 | 96.42,15.81 97.02,15.81 | 97.02,15.81 97.49,15.81 | 97.49,15.81 97.44,14.66 | 97.44,14.66 97.36,12.79 | 97.36,12.79 97.4,12.7 97.55,15.87 | 97.79,17.07 97.79,11.59 97.78,5 J5.2 96.31,5.01 96.4,12.9 | 97.79,17.07 U$1.VCC | R8.2 97.44,14.66 | 96.4,12.9 96.42,14.38 | v45.79,1.46 41.06,1.46 39.94,2.58 R11.2 39.94,10.66 38.32,12.28 Q2.1 37.85,12.26 D1.A | U$1.VCC 97.79,18.43 97.04,17.68 97.04,17.01 97.12,16.92 97.12,15.91 97.02,15.81 | R8.2 98.16,18.16 | 98.16,18.16 97.79,18.53 U$1.VCC | 98.16,18.16 98.16,17.44 97.79,17.07 | 97.36,12.79 97.04,12.47 97.04,5.8 | C8.1 105.5,28.67 v104.37,28.67 103.59,27.89 U$1.CE | C2.1 96.44,14.4 96.42,14.38 | C1.1 96.41,12.9 96.4,12.9
  Bottom 0.254: v101.96,34.12 101.96,29.21 102.5,28.67 v104.37,28.67
  Bottom 1.016: J5.2 96.98,3.06 95.38,1.46 v45.79,1.46
W_PWM  (via drill 0.2)
  Top 0.508: U2.IO15 33.89,25.46 v33.84,25.52 | v33.89,21.8 55.84,21.8 56.4,21.24 R15.2
  Top 1.016: T4.1 56.47,15.72 R15.2
  Bottom 0.508: v33.84,25.52 33.84,21.84 v33.89,21.8
WHITE
  Top 2.54: T4.3 J4.3

### Text on the board
tPlace: SOLAR WIFI LIGHT | RECIEVER CIRCUIT | SFSU PROJECT | VER 1.0 | VCC | GND | 34 | 35 | 32 | 33 | 25 | VCC | VCC | BATTERY | SOLAR | + | - | - | +